# EAGLE design Kopfhörerverstärker AmpBoard Rev 1.0 (EAGLE 6.4)

## Sheet 1 of 3
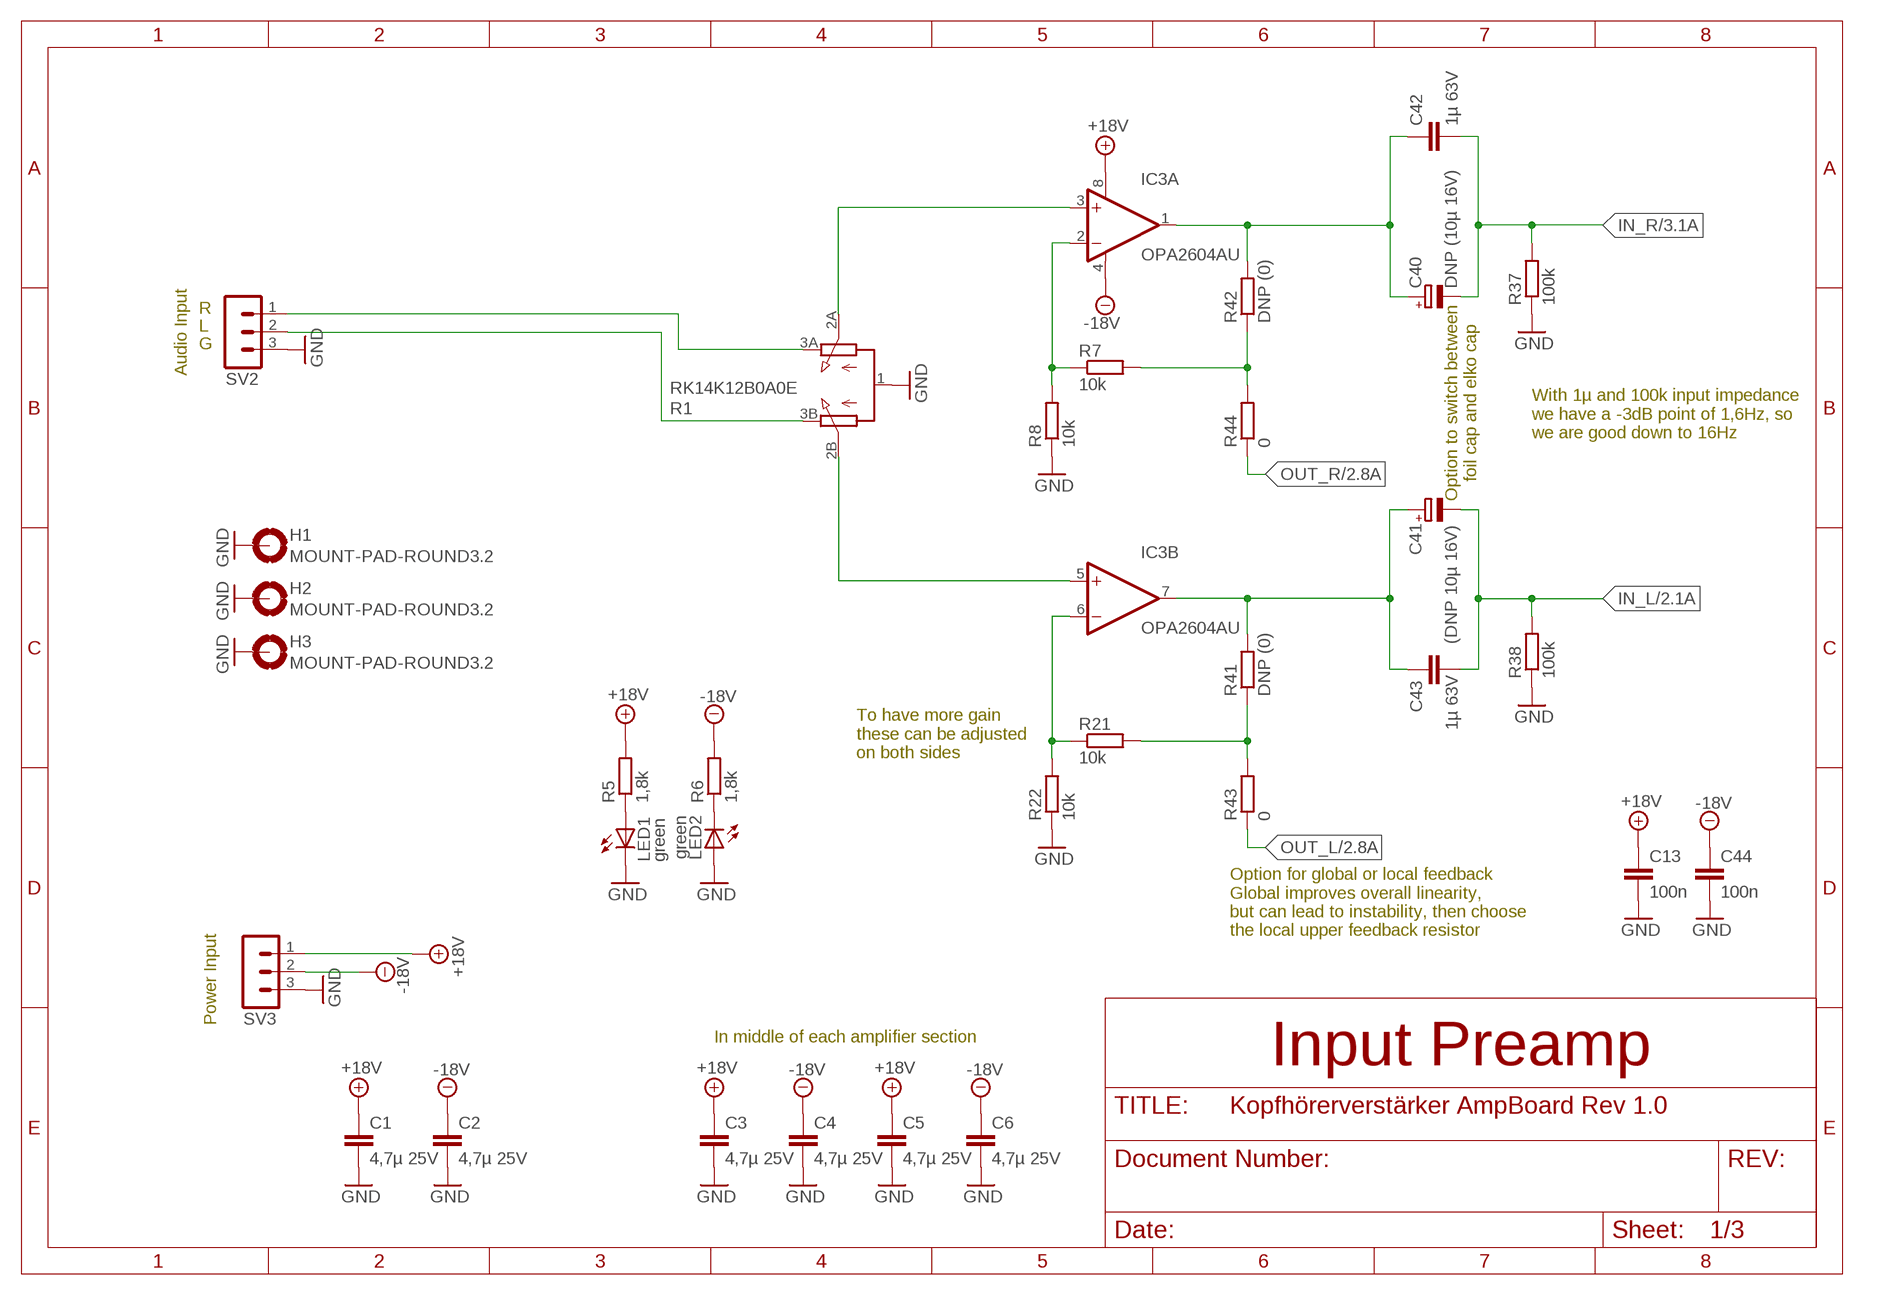
[diagram p0: schematic, sheet 1]

### Parts
C1  4,7µ 25V  C-EUC0805  [C0805]
C2  4,7µ 25V  C-EUC0805  [C0805]
C3  4,7µ 25V  C-EUC0805  [C0805]
C4  4,7µ 25V  C-EUC0805  [C0805]
C5  4,7µ 25V  C-EUC0805  [C0805]
C6  4,7µ 25V  C-EUC0805  [C0805]
C13  100n  C-EUC0805  [C0805]
C40  DNP (10µ 16V)  CPOL-EUE2.5-5  [E2,5-5]
C41  (DNP 10µ 16V)  CPOL-EUE2.5-5  [E2,5-5]
C42  1µ 63V  C-EU050-050X075  [C050-050X075]
C43  1µ 63V  C-EU050-050X075  [C050-050X075]
C44  100n  C-EUC0805  [C0805]
H1  MOUNT-PAD-ROUND3.2  [3,2-PAD]
H2  MOUNT-PAD-ROUND3.2  [3,2-PAD]
H3  MOUNT-PAD-ROUND3.2  [3,2-PAD]
IC3  OPA2604AU  [SO08]
LED1  green  LED3MM  [LED3MM]
LED2  green  LED3MM  [LED3MM]
R1  RK14K12B0A0E  RK14K12X  [RK14K12]
R5  1,8k  R-EU_R0805  [R0805]
R6  1,8k  R-EU_R0805  [R0805]
R7  10k  R-EU_R0805  [R0805]
R8  10k  R-EU_R0805  [R0805]
R21  10k  R-EU_R0805  [R0805]
R22  10k  R-EU_R0805  [R0805]
R37  100k  R-EU_R0805  [R0805]
R38  100k  R-EU_R0805  [R0805]
R41  DNP (0)  R-EU_R0805  [R0805]
R42  DNP (0)  R-EU_R0805  [R0805]
R43  0  R-EU_R0805  [R0805]
R44  0  R-EU_R0805  [R0805]
SV2  MA03-1  [MA03-1]
SV3  MA03-1  [MA03-1]

### Nets
+18V: C1.1 C3.1 C5.1 C13.1 IC3.8(A:V+) R5.2 SV3.1 ; also sheet 2,3
-18V: C2.1 C4.1 C6.1 C44.1 IC3.4(A:V-) R6.2 SV3.2 ; also sheet 2,3
GND: C1.2 C2.2 C3.2 C4.2 C5.2 C6.2 C13.2 C44.2 H1.B3,2(MOUNT) H2.B3,2(MOUNT) H3.B3,2(MOUNT) LED1.K(C) LED2.A R1.1 R8.1 R22.1 R37.1 R38.1 SV2.3 SV3.3 ; also sheet 2,3
IN_L: C41.- C43.2 R38.2 ; also sheet 2
IN_R: C40.- C42.2 R37.2 ; also sheet 3
N$1: R1.3A SV2.1
N$4: R1.3B SV2.2
N$14: LED1.A R5.1
N$15: LED2.K(C) R6.1
N$16: IC3.2(A:-IN) R7.1 R8.2
N$17: C40.+ C42.1 IC3.1(A:OUT) R42.2
N$18: IC3.6(B:-IN) R21.1 R22.2
N$33: IC3.5(B:+IN) R1.2B
N$42: IC3.3(A:+IN) R1.2A
N$47: R21.2 R41.1 R43.2
N$48: R7.2 R42.1 R44.2
N$123: C41.+ C43.1 IC3.7(B:OUT) R41.2
OUT_L: R43.1 ; also sheet 2
OUT_R: R44.1 ; also sheet 2,3

### Notes on the sheet
- R
- Audio Input | L
- G
- Option to switch between
  foil cap and elko cap
- With 1µ and 100k input impedance
  we have a -3dB point of 1,6Hz, so 
  we are good down to 16Hz
- To have more gain
  these can be adjusted
  on both sides
- Option for global or local feedback
  Global improves overall linearity,
  but can lead to instability, then choose
  the local upper feedback resistor
- Power Input
- In middle of each amplifier section | Input Preamp

## Sheet 2 of 3
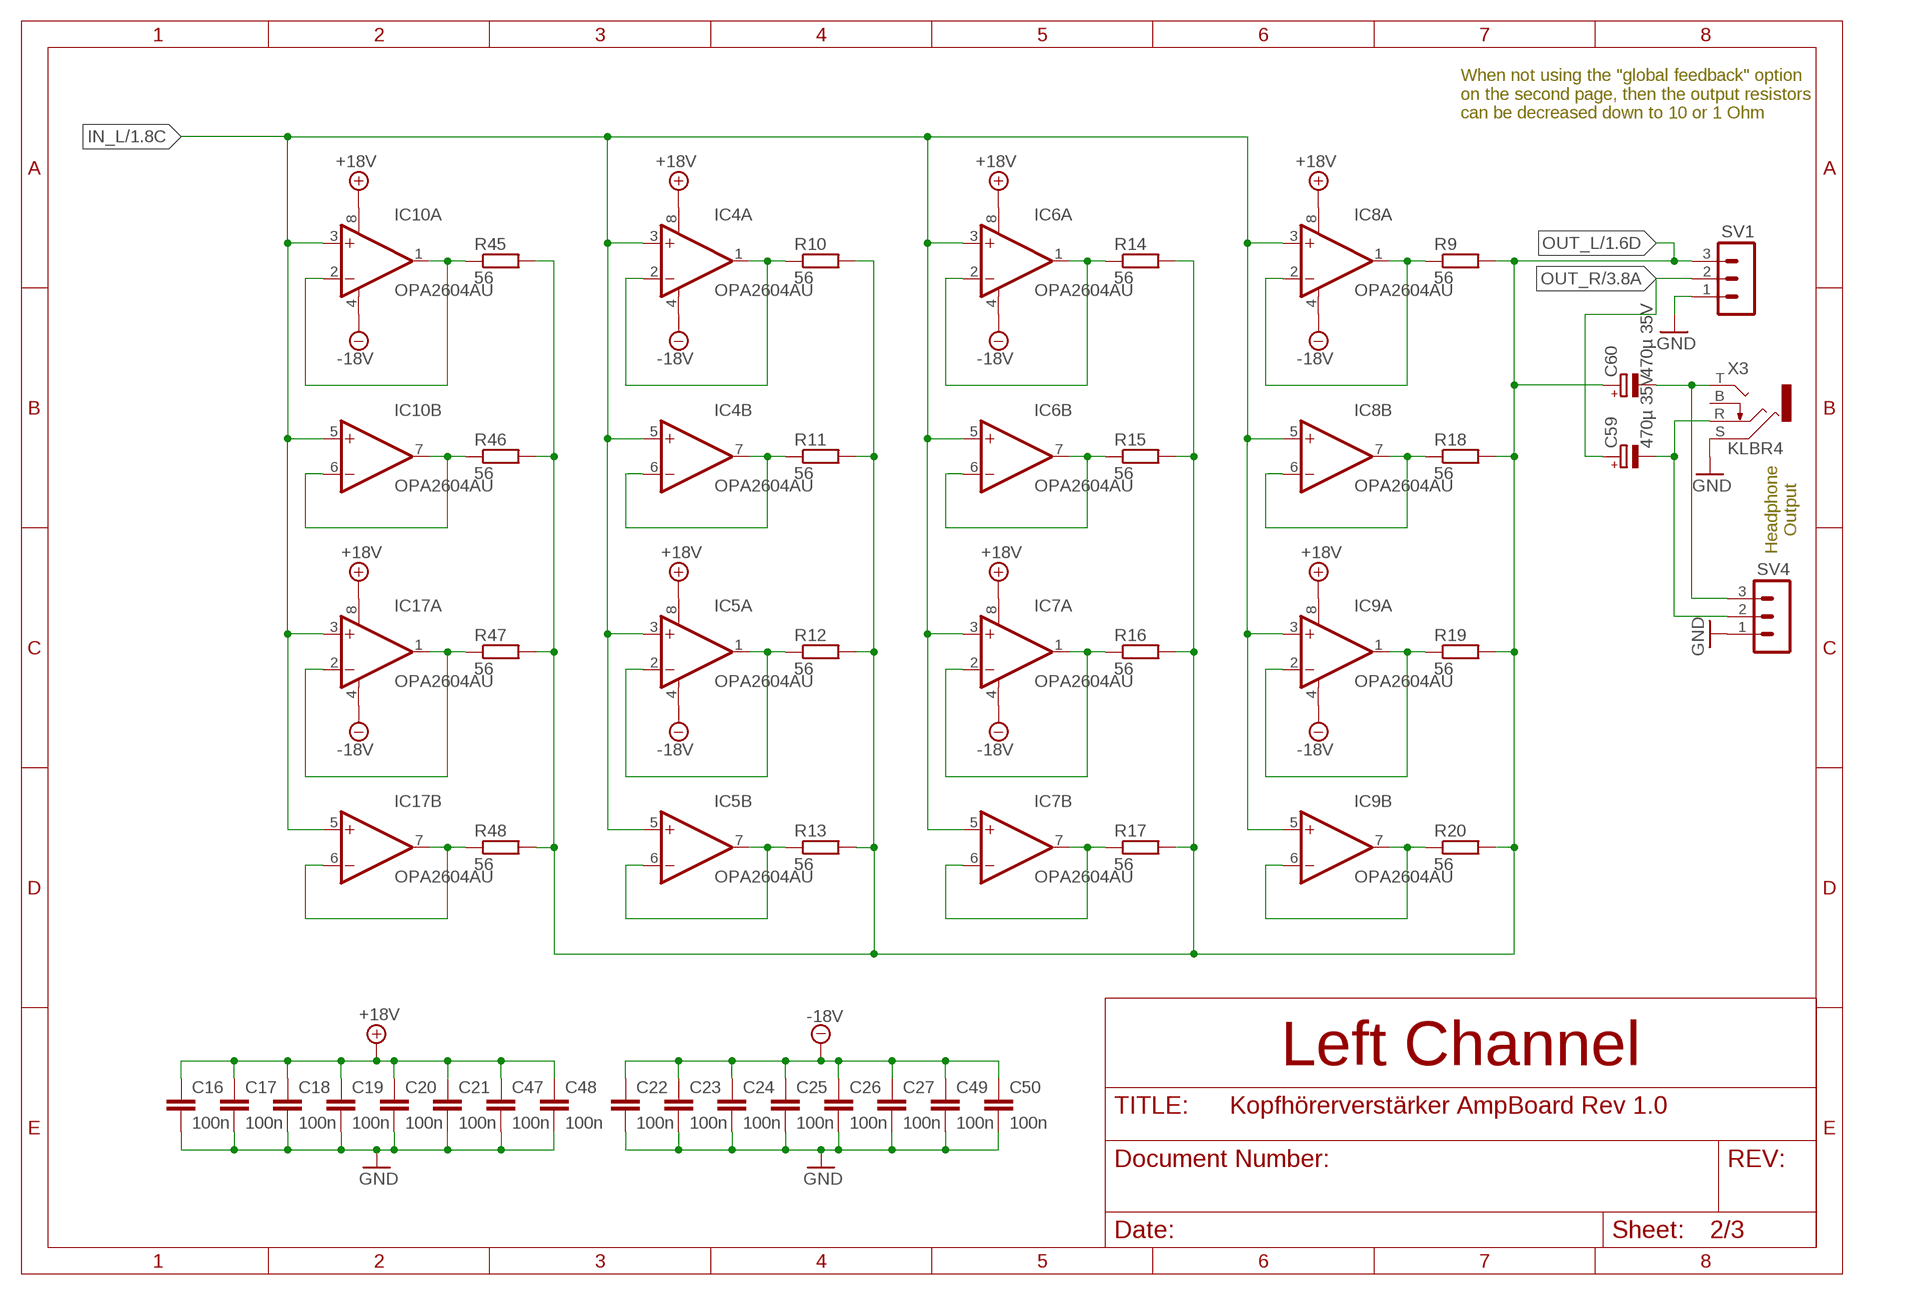
[diagram p1: schematic, sheet 2]

### Parts
C16  100n  C-EUC0805  [C0805]
C17  100n  C-EUC0805  [C0805]
C18  100n  C-EUC0805  [C0805]
C19  100n  C-EUC0805  [C0805]
C20  100n  C-EUC0805  [C0805]
C21  100n  C-EUC0805  [C0805]
C22  100n  C-EUC0805  [C0805]
C23  100n  C-EUC0805  [C0805]
C24  100n  C-EUC0805  [C0805]
C25  100n  C-EUC0805  [C0805]
C26  100n  C-EUC0805  [C0805]
C27  100n  C-EUC0805  [C0805]
C47  100n  C-EUC0805  [C0805]
C48  100n  C-EUC0805  [C0805]
C49  100n  C-EUC0805  [C0805]
C50  100n  C-EUC0805  [C0805]
C59  470µ 35V  CPOL-EUE5-10.5  [E5-10,5]
C60  470µ 35V  CPOL-EUE5-10.5  [E5-10,5]
IC4  OPA2604AU  [SO08]
IC5  OPA2604AU  [SO08]
IC6  OPA2604AU  [SO08]
IC7  OPA2604AU  [SO08]
IC8  OPA2604AU  [SO08]
IC9  OPA2604AU  [SO08]
IC10  OPA2604AU  [SO08]
IC17  OPA2604AU  [SO08]
R9  56  R-EU_R0805  [R0805]
R10  56  R-EU_R0805  [R0805]
R11  56  R-EU_R0805  [R0805]
R12  56  R-EU_R0805  [R0805]
R13  56  R-EU_R0805  [R0805]
R14  56  R-EU_R0805  [R0805]
R15  56  R-EU_R0805  [R0805]
R16  56  R-EU_R0805  [R0805]
R17  56  R-EU_R0805  [R0805]
R18  56  R-EU_R0805  [R0805]
R19  56  R-EU_R0805  [R0805]
R20  56  R-EU_R0805  [R0805]
R45  56  R-EU_R0805  [R0805]
R46  56  R-EU_R0805  [R0805]
R47  56  R-EU_R0805  [R0805]
R48  56  R-EU_R0805  [R0805]
SV1  MA03-1  [MA03-1]
SV4  MA03-1  [MA03-1]
X3  KLBR4  [KLBR4]

### Nets
+18V: C16.1 C17.1 C18.1 C19.1 C20.1 C21.1 C47.1 C48.1 IC4.8(A:V+) IC5.8(A:V+) IC6.8(A:V+) IC7.8(A:V+) IC8.8(A:V+) IC9.8(A:V+) IC10.8(A:V+) IC17.8(A:V+) ; also sheet 1,3
-18V: C22.1 C23.1 C24.1 C25.1 C26.1 C27.1 C49.1 C50.1 IC4.4(A:V-) IC5.4(A:V-) IC6.4(A:V-) IC7.4(A:V-) IC8.4(A:V-) IC9.4(A:V-) IC10.4(A:V-) IC17.4(A:V-) ; also sheet 1,3
GND: C16.2 C17.2 C18.2 C19.2 C20.2 C21.2 C22.2 C23.2 C24.2 C25.2 C26.2 C27.2 C47.2 C48.2 C49.2 C50.2 SV1.1 SV4.1 X3.S ; also sheet 1,3
IN_L: IC4.3(A:+IN) IC4.5(B:+IN) IC5.3(A:+IN) IC5.5(B:+IN) IC6.3(A:+IN) IC6.5(B:+IN) IC7.3(A:+IN) IC7.5(B:+IN) IC8.3(A:+IN) IC8.5(B:+IN) IC9.3(A:+IN) IC9.5(B:+IN) IC10.3(A:+IN) IC10.5(B:+IN) IC17.3(A:+IN) IC17.5(B:+IN) ; also sheet 1
N$2: C59.- SV4.2 X3.R
N$3: C60.- SV4.3 X3.T
N$12: IC4.6(B:-IN) IC4.7(B:OUT) R11.1
N$13: IC5.1(A:OUT) IC5.2(A:-IN) R12.1
N$19: IC8.1(A:OUT) IC8.2(A:-IN) R9.1
N$21: IC4.1(A:OUT) IC4.2(A:-IN) R10.1
N$22: IC5.6(B:-IN) IC5.7(B:OUT) R13.1
N$23: IC6.1(A:OUT) IC6.2(A:-IN) R14.1
N$24: IC6.6(B:-IN) IC6.7(B:OUT) R15.1
N$25: IC7.1(A:OUT) IC7.2(A:-IN) R16.1
N$26: IC7.6(B:-IN) IC7.7(B:OUT) R17.1
N$28: IC8.6(B:-IN) IC8.7(B:OUT) R18.1
N$29: IC9.1(A:OUT) IC9.2(A:-IN) R19.1
N$30: IC9.6(B:-IN) IC9.7(B:OUT) R20.1
N$50: IC10.1(A:OUT) IC10.2(A:-IN) R45.1
N$51: IC10.6(B:-IN) IC10.7(B:OUT) R46.1
N$52: IC17.1(A:OUT) IC17.2(A:-IN) R47.1
N$53: IC17.6(B:-IN) IC17.7(B:OUT) R48.1
OUT_L: C60.+ R9.2 R10.2 R11.2 R12.2 R13.2 R14.2 R15.2 R16.2 R17.2 R18.2 R19.2 R20.2 R45.2 R46.2 R47.2 R48.2 SV1.3 ; also sheet 1
OUT_R: C59.+ SV1.2 ; also sheet 1,3
Unconnected: X3.B

### Notes on the sheet
- When not using the "global feedback" option
  on the second page, then the output resistors
  can be decreased down to 10 or 1 Ohm
- Headphone
  Output
- Left Channel

## Sheet 3 of 3
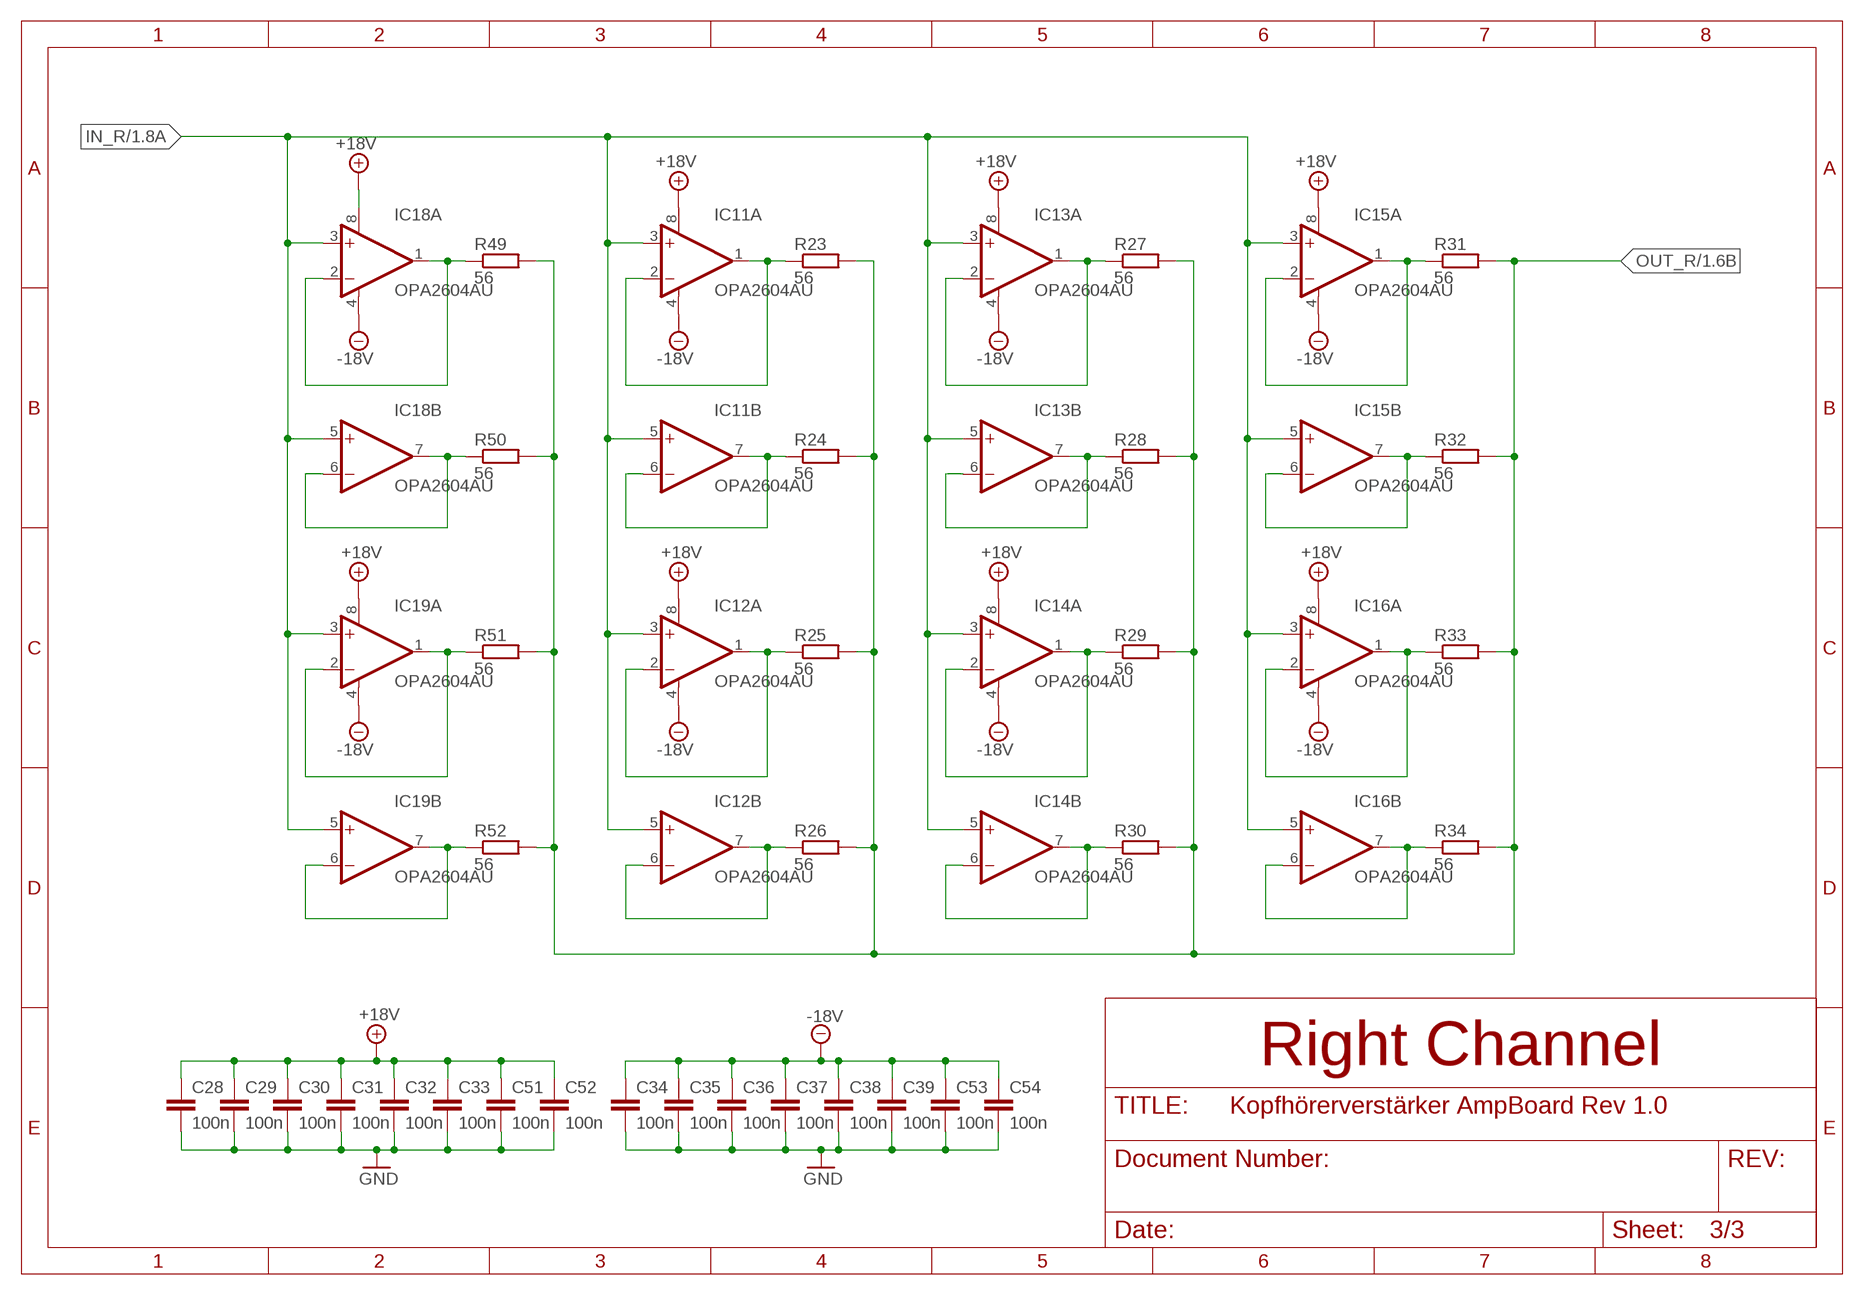
[diagram p2: schematic, sheet 3]

### Parts
C28  100n  C-EUC0805  [C0805]
C29  100n  C-EUC0805  [C0805]
C30  100n  C-EUC0805  [C0805]
C31  100n  C-EUC0805  [C0805]
C32  100n  C-EUC0805  [C0805]
C33  100n  C-EUC0805  [C0805]
C34  100n  C-EUC0805  [C0805]
C35  100n  C-EUC0805  [C0805]
C36  100n  C-EUC0805  [C0805]
C37  100n  C-EUC0805  [C0805]
C38  100n  C-EUC0805  [C0805]
C39  100n  C-EUC0805  [C0805]
C51  100n  C-EUC0805  [C0805]
C52  100n  C-EUC0805  [C0805]
C53  100n  C-EUC0805  [C0805]
C54  100n  C-EUC0805  [C0805]
IC11  OPA2604AU  [SO08]
IC12  OPA2604AU  [SO08]
IC13  OPA2604AU  [SO08]
IC14  OPA2604AU  [SO08]
IC15  OPA2604AU  [SO08]
IC16  OPA2604AU  [SO08]
IC18  OPA2604AU  [SO08]
IC19  OPA2604AU  [SO08]
R23  56  R-EU_R0805  [R0805]
R24  56  R-EU_R0805  [R0805]
R25  56  R-EU_R0805  [R0805]
R26  56  R-EU_R0805  [R0805]
R27  56  R-EU_R0805  [R0805]
R28  56  R-EU_R0805  [R0805]
R29  56  R-EU_R0805  [R0805]
R30  56  R-EU_R0805  [R0805]
R31  56  R-EU_R0805  [R0805]
R32  56  R-EU_R0805  [R0805]
R33  56  R-EU_R0805  [R0805]
R34  56  R-EU_R0805  [R0805]
R49  56  R-EU_R0805  [R0805]
R50  56  R-EU_R0805  [R0805]
R51  56  R-EU_R0805  [R0805]
R52  56  R-EU_R0805  [R0805]

### Nets
+18V: C28.1 C29.1 C30.1 C31.1 C32.1 C33.1 C51.1 C52.1 IC11.8(A:V+) IC12.8(A:V+) IC13.8(A:V+) IC14.8(A:V+) IC15.8(A:V+) IC16.8(A:V+) IC18.8(A:V+) IC19.8(A:V+) ; also sheet 1,2
-18V: C34.1 C35.1 C36.1 C37.1 C38.1 C39.1 C53.1 C54.1 IC11.4(A:V-) IC12.4(A:V-) IC13.4(A:V-) IC14.4(A:V-) IC15.4(A:V-) IC16.4(A:V-) IC18.4(A:V-) IC19.4(A:V-) ; also sheet 1,2
GND: C28.2 C29.2 C30.2 C31.2 C32.2 C33.2 C34.2 C35.2 C36.2 C37.2 C38.2 C39.2 C51.2 C52.2 C53.2 C54.2 ; also sheet 1,2
IN_R: IC11.3(A:+IN) IC11.5(B:+IN) IC12.3(A:+IN) IC12.5(B:+IN) IC13.3(A:+IN) IC13.5(B:+IN) IC14.3(A:+IN) IC14.5(B:+IN) IC15.3(A:+IN) IC15.5(B:+IN) IC16.3(A:+IN) IC16.5(B:+IN) IC18.3(A:+IN) IC18.5(B:+IN) IC19.3(A:+IN) IC19.5(B:+IN) ; also sheet 1
N$20: IC11.1(A:OUT) IC11.2(A:-IN) R23.1
N$27: IC11.6(B:-IN) IC11.7(B:OUT) R24.1
N$31: IC12.1(A:OUT) IC12.2(A:-IN) R25.1
N$32: IC12.6(B:-IN) IC12.7(B:OUT) R26.1
N$34: IC13.1(A:OUT) IC13.2(A:-IN) R27.1
N$35: IC13.6(B:-IN) IC13.7(B:OUT) R28.1
N$36: IC14.1(A:OUT) IC14.2(A:-IN) R29.1
N$37: IC14.6(B:-IN) IC14.7(B:OUT) R30.1
N$38: IC15.1(A:OUT) IC15.2(A:-IN) R31.1
N$39: IC15.6(B:-IN) IC15.7(B:OUT) R32.1
N$40: IC16.1(A:OUT) IC16.2(A:-IN) R33.1
N$41: IC16.6(B:-IN) IC16.7(B:OUT) R34.1
N$49: IC18.1(A:OUT) IC18.2(A:-IN) R49.1
N$55: IC18.6(B:-IN) IC18.7(B:OUT) R50.1
N$56: IC19.1(A:OUT) IC19.2(A:-IN) R51.1
N$57: IC19.6(B:-IN) IC19.7(B:OUT) R52.1
OUT_R: R23.2 R24.2 R25.2 R26.2 R27.2 R28.2 R29.2 R30.2 R31.2 R32.2 R33.2 R34.2 R49.2 R50.2 R51.2 R52.2 ; also sheet 1,2

### Notes on the sheet
- Right Channel

## Library data of the parts
C1-C6 C13 C16-C39 C42-C44 C47-C54 = rcl:C-EU: CAPACITOR, European symbol
C40 C41 C59 C60 = rcl:CPOL-EU: POLARIZED CAPACITOR, European symbol
H1-H3 = holes:MOUNT-PAD-ROUND: MOUNTING PAD, round
IC3-IC19 = burr-brown:OPA2604: Dual FET-Input, Low Distortion LOW DISTORTION: 0.0003% at 1kHz LOW NOISE: 10nV/vHz HIGH SLEW RATE: 25V/µ s WIDE GAIN-BANDWIDTH: 20MHz UNITY-GAIN STABLE WIDE SUPPLY RANGE: VS = ±4.5 to ±24V DRIVES 600? LOADS
LED1 LED2 = led:LED: LED OSRAM: - CHIPLED LG R971, LG N971, LY N971, LG Q971, LY Q971, LO R971, LY R971 LH N974, LH R974 LS Q976, LO Q976, LY Q976 LO Q996 - Hyper CHIPLED LW Q18S LB Q993, LB Q99A, LB R99A - SideLED LS A670, LO A670, LY A670, LG A670, LP A670 LB A673, LV A673, LT A673, LW A673 LH A674 LY A675 LS A676, LA A676, LO A676, LY A676, LW A676 LS A679, LY A679, LG A679 - Hyper Micro SIDELED® LS Y876, LA Y876, LO Y876, LY Y876 LT Y87S - SmartLED LW L88C, LW L88S LB L89C, LB L89S, LG L890 LS L89K, LO L89K, LY L89K LS L896, LA L896, LO L896, LY L896 - TOPLED LS T670, LO T670, LY T670, LG T670, LP T670 LSG T670, LSP T670, LSY T670, LOP T670, LYG T670 LG T671, LOG T671, LSG T671 LB T673, LV T673, LT T673, LW T673 LH T674 LS T676, LA T676, LO T676, LY T676, LB T676, LH T676, LSB T676, LW T676 LB T67C, LV T67C, LT T67C, LS T67K, LO T67K, LY T67K, LW E67C LS E67B, LA E67B, LO E67B, LY E67B, LB E67C, LV E67C, LT E67C LW T67C LS T679, LY T679, LG T679 LS T770, LO T770, LY T770, LG T770, LP T770 LB T773, LV T773, LT T773, LW T773 LH T774 LS E675, LA E675, LY E675, LS T675 LS T776, LA T776, LO T776, LY T776, LB T776 LHGB T686 LT T68C, LB T68C - Hyper Mini TOPLED® LB M676 - Mini TOPLED Santana® LG M470 LS M47K, LO M47K, LY M47K Source: http://www.osram.convergy.de LUXEON: - LUMILED® LXK2-PW12-R00, LXK2-PW12-S00, LXK2-PW14-U00, LXK2-PW14-V00 LXK2-PM12-R00, LXK2-PM12-S00, LXK2-PM14-U00 LXK2-PE12-Q00, LXK2-PE12-R00, LXK2-PE12-S00, LXK2-PE14-T00, LXK2-PE14-U00 LXK2-PB12-K00, LXK2-PB12-L00, LXK2-PB12-M00, LXK2-PB14-N00, LXK2-PB14-P00, LXK2-PB14-Q00 LXK2-PR12-L00, LXK2-PR12-M00, LXK2-PR14-Q00, LXK2-PR14-R00 LXK2-PD12-Q00, LXK2-PD12-R00, LXK2-PD12-S00 LXK2-PH12-R00, LXK2-PH12-S00 LXK2-PL12-P00, LXK2-PL12-Q00, LXK2-PL12-R00 Source: www.luxeon.com KINGBRIGHT: KA-3528ASYC Source: www.kingbright.com
R1 = pot:RK14K12X: RK14K Series Features - Closed structure improved dust-proofing capacity and flux resistance - Available with bushing, tap and detent Applications - Sound volume, tone and balance controls for audio devices - Controls for audio mixes, musical instruments and image devicesincluding DVD players
R5-R34 R37 R38 R41-R52 = rcl:R-EU_: RESISTOR, European symbol
SV1-SV4 = con-lstb:MA03-1: PIN HEADER; OC_FARNELL: unknown; OC_NEWARK: unknown
X3 = con-lumberg:KLBR4: Jack connectors according to JISC 6560, 3.5 mm Klinkeneinbaukupplung nach JISC 6560, 3,5 mm, 3-polig/ stereo, abgewinkelte Ausführung, mit Öffner, für Leiterplatten Source: Data sheet <http://www.lumberg.com/Produkte/PDFs/KLBR4.pdf>; MPN: KLBR 4; OC_FARNELL: 1217016; OC_NEWARK: 97K2709

## Board
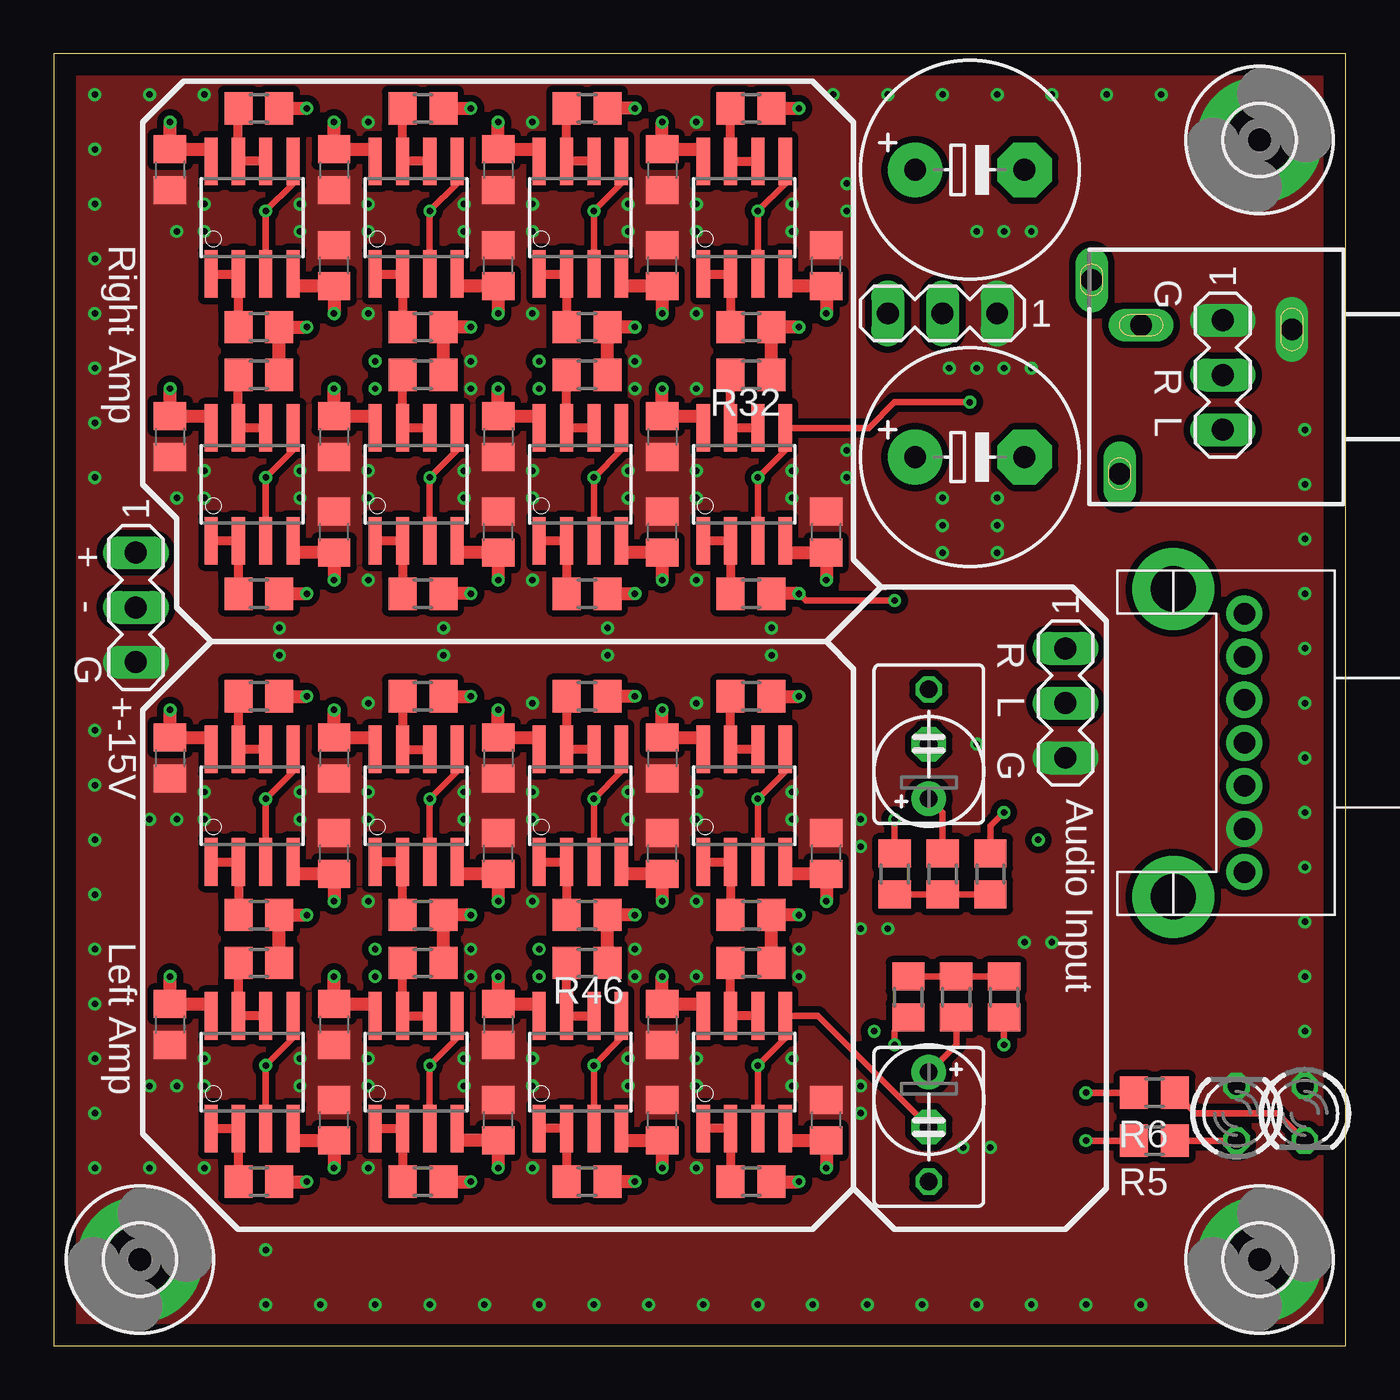
[diagram p3: board, top side]
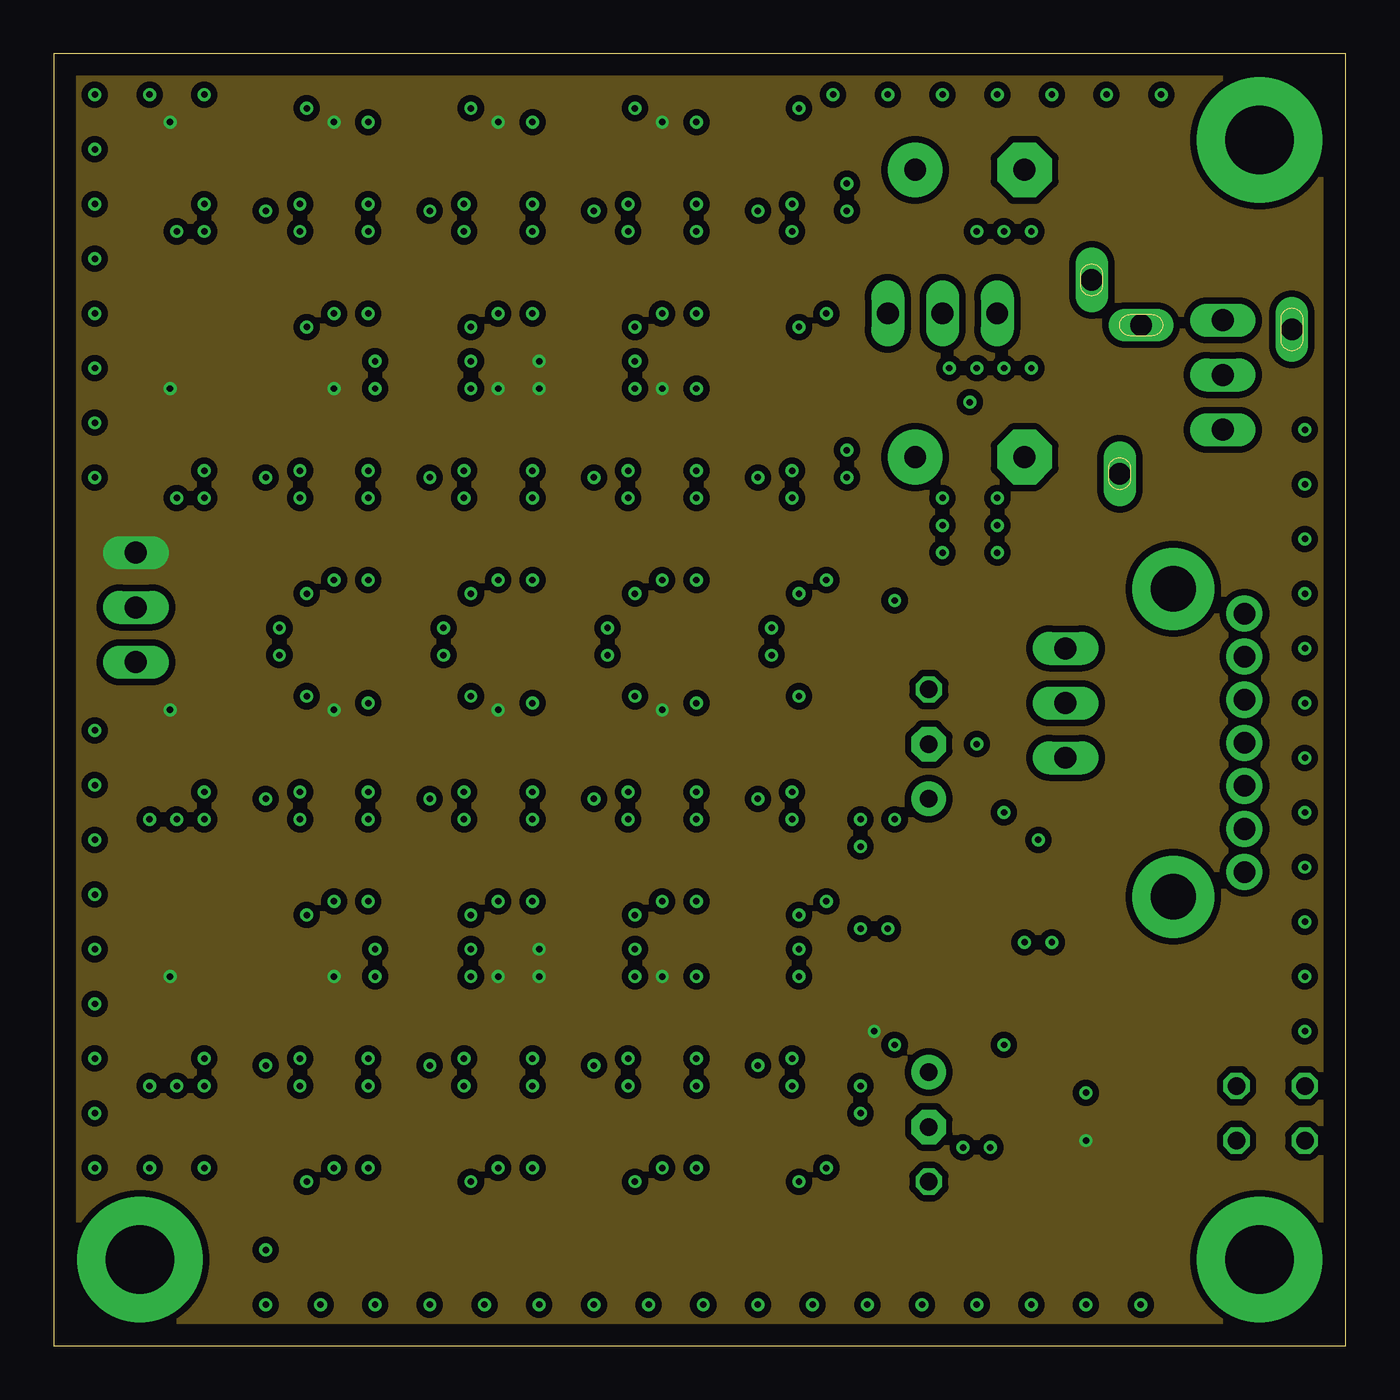
[diagram p4: board, inner layer Route2]
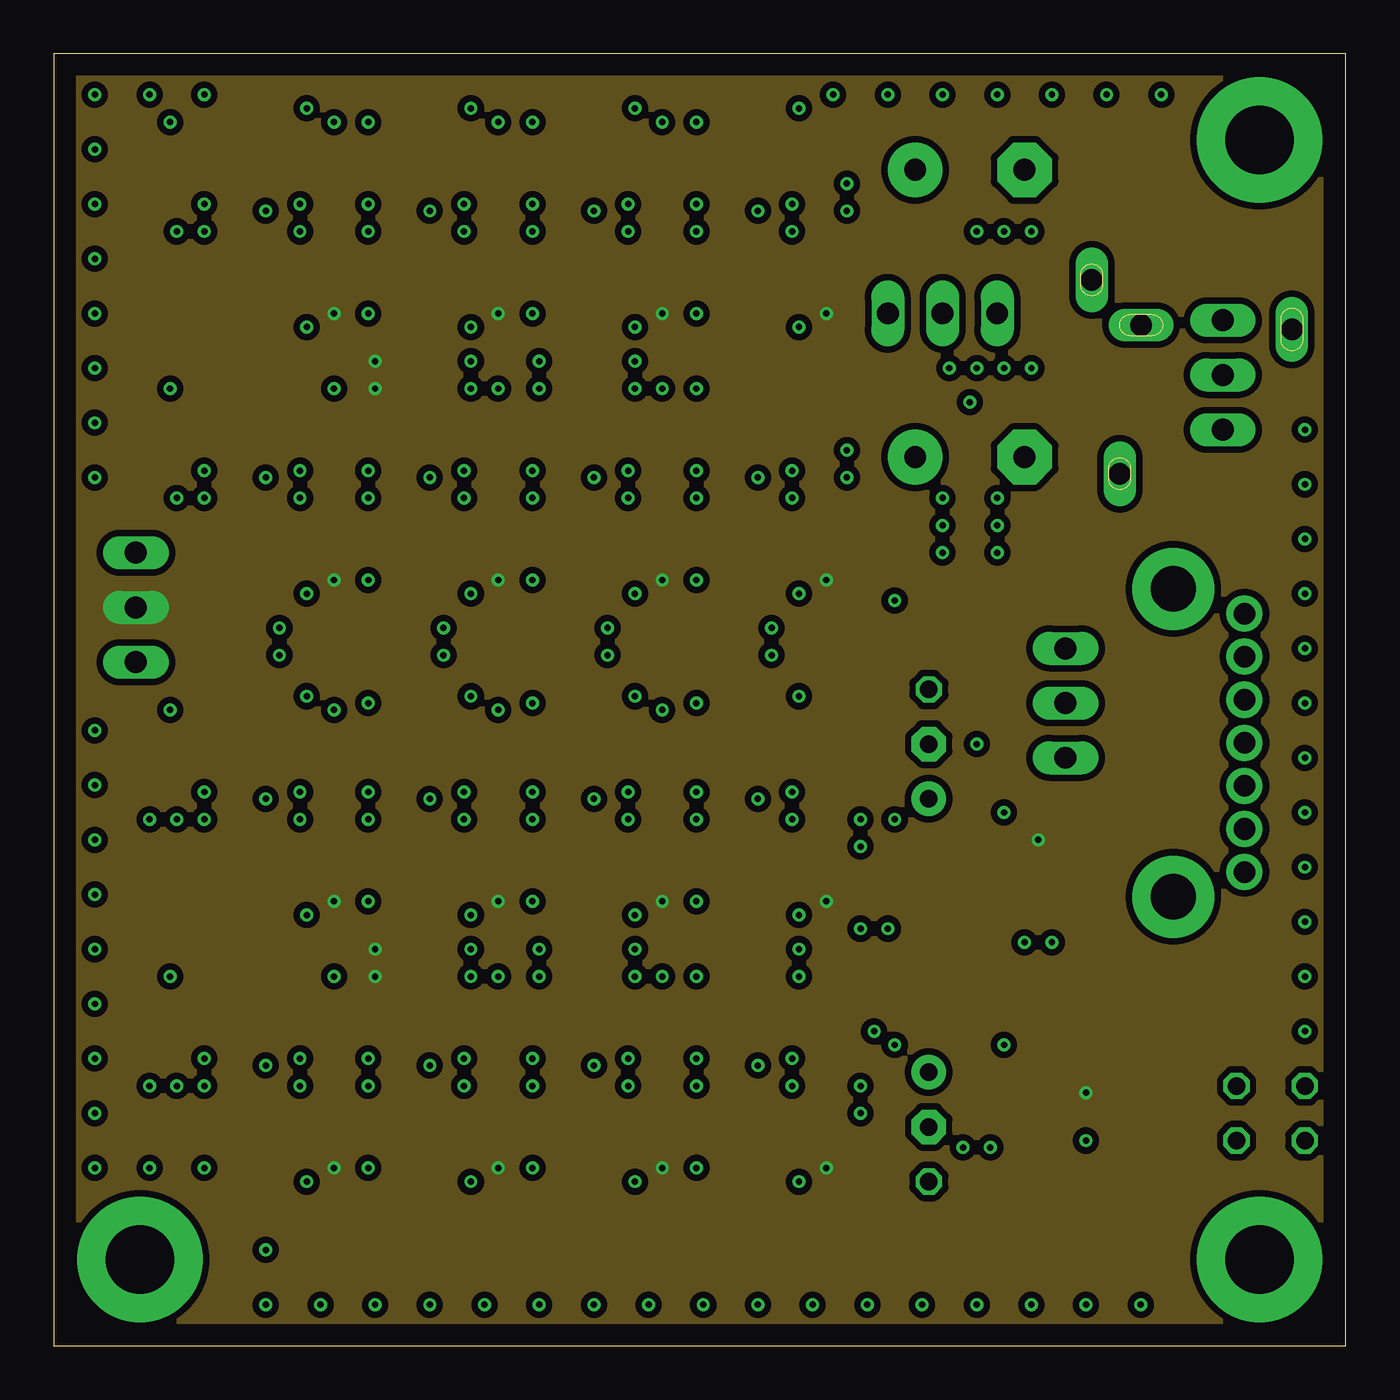
[diagram p5: board, inner layer Route15]
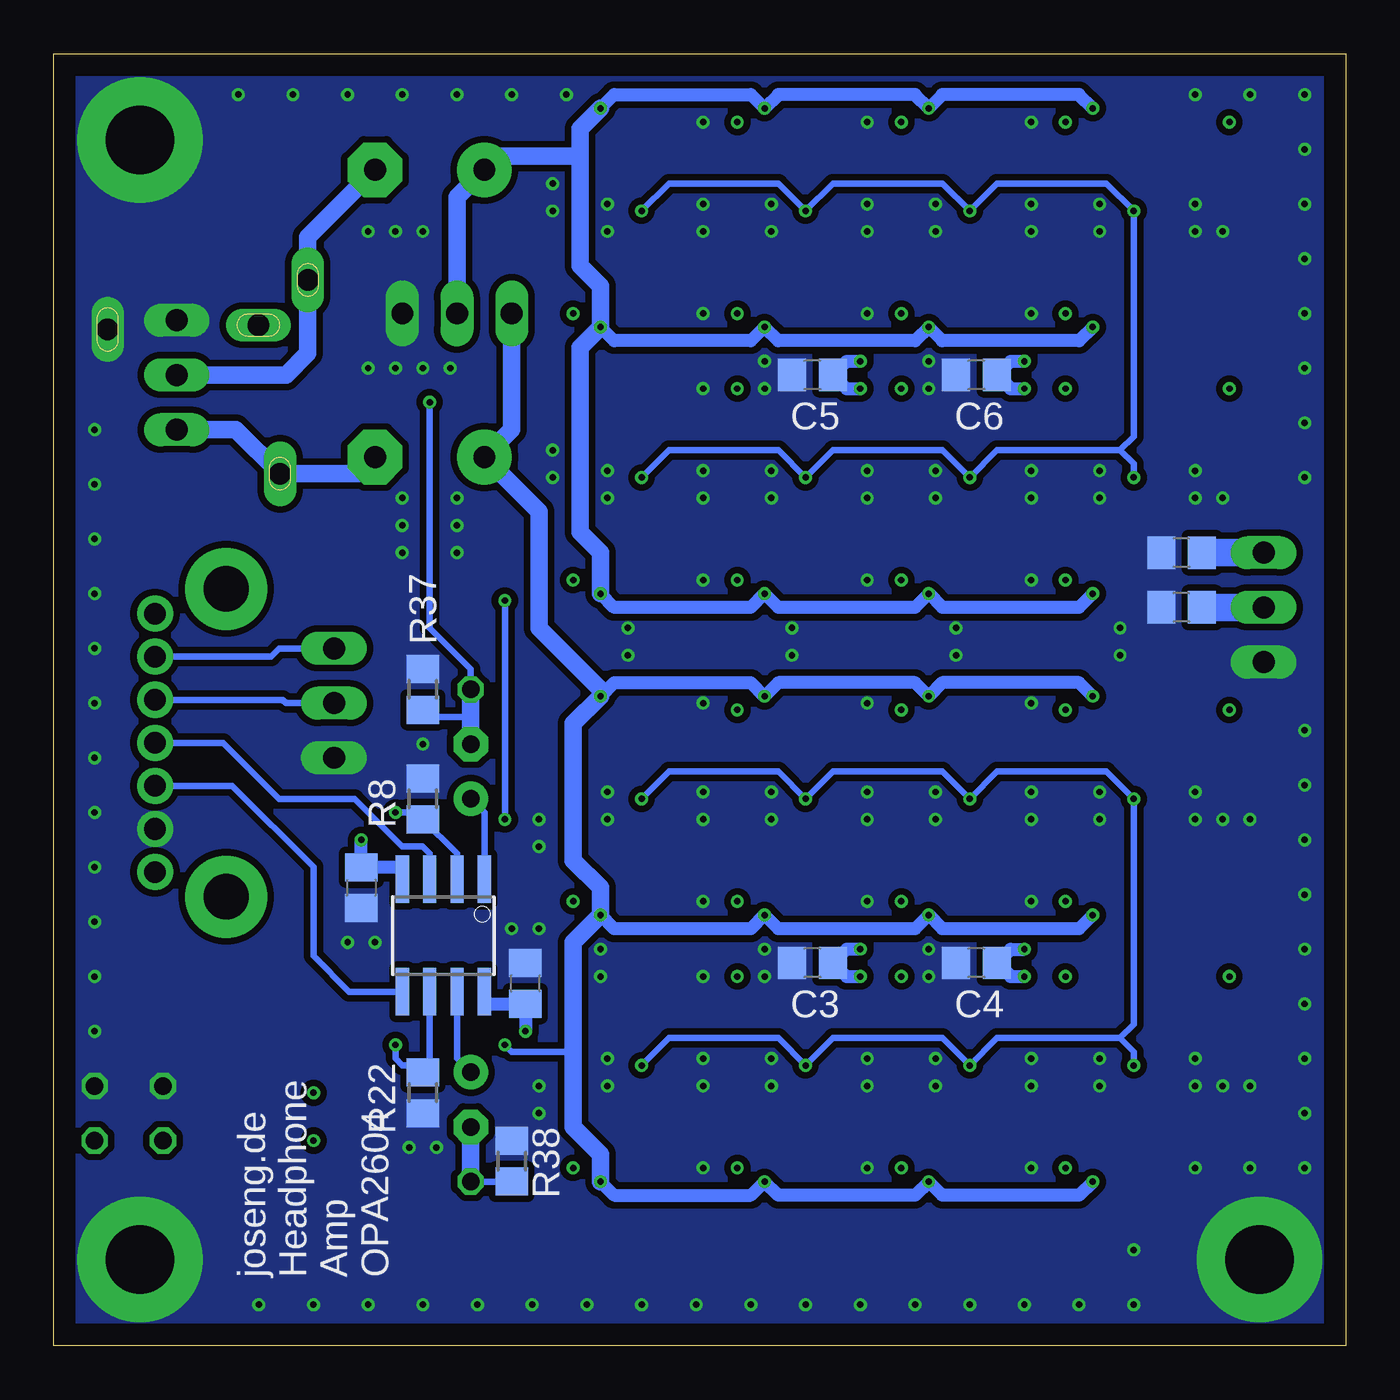
[diagram p6: board, bottom side, seen from below]

Size 60 x 60 mm. Coordinates in mm from the lower left corner, seen from the top.
Outline: 0,0 60,0 60,60 0,60 0,0
Copper layers ((1+2)*(15+16)): Top 0.035mm / dielectric 0.2mm / Route2 0.0175mm / dielectric 1.065mm / Route15 0.0175mm / dielectric 0.2mm / Bottom 0.035mm
Design rules "JLCPCB 4Layer 1oz JLC7628": minimum track width 3.5mil, minimum drill 0.2mm, track to track 3.5mil, track to pad 0.2mm, pad to pad 5mil, via to via 0.2mm, smd to smd 5mil, copper to edge 40mil, drill to drill 0.5mm, minimum pad ring 0.15mm, minimum via ring 0.15mm, stop-mask expansion 2mil, vias tented up to drill 0.3mm, thermal gap 10mil

### Footprints (pad centres in the part's own frame; a part is rotated, then mirrored left to right if it is on the bottom)
C0805 = smd 1.3 x 1.5: 1 -0.95,0; 2 0.95,0
E2,5-5 = drill 0.813 pad 1.6: + -1.27,0 | drill 0.813 pad 1.6 octagon: - 1.27,0
C050-050X075 = drill 0.813 octagon: 1 -2.54,0; 2 2.54,0
E5-10,5 = drill 1.016 pad 2.54: + -2.54,0 | drill 1.016 pad 2.54 octagon: - 2.54,0
3,2-PAD = drill 3.2 pad 5.842: B3,2 0,0
SO08 = smd 0.61 x 2.21: 1 -1.905,-2.616; 2 -0.635,-2.616; 3 0.635,-2.616; 4 1.905,-2.616; 5 1.905,2.616; 6 0.635,2.616; 7 -0.635,2.616; 8 -1.905,2.616
LED3MM = drill 0.813 octagon: A -1.27,0; K 1.27,0
RK14K12 = drill 1 pad 1.676: 1 3.3,-4; 2A 3.3,0; 2B 3.3,-2; 3A 3.3,4; 3B 3.3,2; D1 3.3,-6; D2 3.3,6 | drill 2.1 pad 3.81: M1 0,7.15; M2 0,-7.15
R0805 = smd 1.3 x 1.5: 1 -0.95,0; 2 0.95,0
MA03-1 = drill 1.016 long: 1 -2.54,0; 2 0,0; 3 2.54,0
KLBR4 = drill 1 pad 1.3 long: B -2.4,-3.5; S -2.2,3.5 | drill 1 pad 1.2 long: R -4.5,-5.8; T 4.5,-4.5

### Placement (x,y rotation side)
C1  7.62,36.83 180 bottom
C2  7.62,34.29 180 bottom
C3  24.77,17.78 180 bottom
C4  17.14,17.78 180 bottom
C5  24.77,45.09 180 bottom
C6  17.14,45.09 180 bottom
C13  38.1,16.83 90 bottom
C16  5.4,27.3 270 top
C17  13.02,27.3 270 top
C18  20.64,27.3 270 top
C19  28.26,27.3 270 top
C20  5.4,14.92 270 top
C21  13.02,14.92 270 top
C22  13.02,22.86 90 top
C23  20.64,22.86 90 top
C24  28.26,22.86 90 top
C25  35.88,22.86 90 top
C26  13.02,10.48 90 top
C27  20.64,10.48 90 top
C28  28.26,54.61 270 top
C29  20.64,54.61 270 top
C30  13.02,54.61 270 top
C31  5.4,54.61 270 top
C32  28.26,42.23 270 top
C33  20.64,42.23 270 top
C34  35.88,50.16 90 top
C35  28.26,50.16 90 top
C36  20.64,50.16 90 top
C37  13.02,50.16 90 top
C38  35.88,37.78 90 top
C39  28.26,37.78 90 top
C40  40.64,26.67 90 top
C41  40.64,11.43 270 top
C42  40.64,27.94 90 top
C43  40.64,10.16 270 top
C44  45.72,21.27 270 bottom
C47  20.64,14.92 270 top
C48  28.26,14.92 270 top
C49  28.26,10.48 90 top
C50  35.88,10.48 90 top
C51  13.02,42.23 270 top
C52  5.4,42.23 270 top
C53  20.64,37.78 90 top
C54  13.02,37.78 90 top
C59  42.55,54.61 0 top
C60  42.55,41.27 0 top
H1  4,4 0 top
H2  56,56 0 top
H3  56,4 0 top
IC3  41.91,19.05 180 bottom
IC4  9.21,25.08 0 top
IC5  16.83,25.08 0 top
IC6  24.45,25.08 0 top
IC7  32.07,25.08 0 top
IC8  9.21,12.7 0 top
IC9  16.83,12.7 0 top
IC10  24.45,12.7 0 top
IC11  32.07,52.39 0 top
IC12  24.45,52.39 0 top
IC13  16.83,52.39 0 top
IC14  9.21,52.39 0 top
IC15  32.07,40.01 0 top
IC16  24.45,40.01 0 top
IC17  32.07,12.7 0 top
IC18  16.83,40.01 0 top
IC19  9.21,40.01 0 top
LED1  54.93,10.79 90 top
LED2  58.1,10.79 270 top
R1  52,28 0 top
R5  51.12,9.53 180 top
R6  51.12,11.75 180 top
R7  43.5,21.91 270 top
R8  42.86,25.4 270 bottom
R9  9.53,7.62 0 top
R10  9.53,20 0 top
R11  9.53,30.16 0 top
R12  17.14,20 0 top
R13  17.14,30.16 0 top
R14  24.77,20 0 top
R15  24.77,30.16 0 top
R16  32.38,20 0 top
R17  32.38,30.16 0 top
R18  9.53,17.78 0 top
R19  17.14,7.62 0 top
R20  17.14,17.78 0 top
R21  44.13,16.19 90 top
R22  42.86,11.75 90 bottom
R23  32.38,47.31 0 top
R24  32.38,57.47 0 top
R25  24.77,47.31 0 top
R26  24.77,57.47 0 top
R27  17.14,47.31 0 top
R28  17.14,57.47 0 top
R29  9.53,47.31 0 top
R30  9.53,57.47 0 top
R31  32.38,34.92 0 top
R32  32.38,45.09 0 top
R33  24.77,34.92 0 top
R34  24.77,45.09 0 top
R37  42.86,30.48 270 bottom
R38  38.73,8.57 270 bottom
R41  41.91,16.19 270 top
R42  41.27,21.91 90 top
R43  39.69,16.19 90 top
R44  39.05,21.91 270 top
R45  24.77,7.62 0 top
R46  24.77,17.78 0 top
R47  32.38,7.62 0 top
R48  32.38,17.78 0 top
R49  17.14,34.92 0 top
R50  17.14,45.09 0 top
R51  9.53,34.92 0 top
R52  9.53,45.09 0 top
SV1  41.27,47.94 180 top
SV2  46.99,29.84 270 top
SV3  3.81,34.29 270 top
SV4  54.29,45.09 270 top
X3  54,45 270 top

### Tracks (layer width: path | path; a pad name or v marks a point on that pad's centre or on a via)
+18V  (via drill 0.3, 0.3 pad 0.3)
  Top 0.305: R5.2 v47.94,9.53
  Top 0.61: v28.26,29.53 C19.1 30.16,28.25 IC7.8 | IC5.8 14.92,28.25 C17.1 v13.02,29.53 | IC4.8 7.3,28.25 C16.1 v5.4,29.53 | IC6.8 22.54,28.25 C18.1 v20.64,29.53 | v20.64,17.14 C47.1 22.54,15.87 IC10.8 | IC17.8 30.16,15.87 C48.1 v28.26,17.14 | IC9.8 14.92,15.87 C21.1 v13.02,17.14 | IC8.8 7.3,15.87 C20.1 v5.4,17.14 | v20.64,56.83 C29.1 22.54,55.56 IC12.8 | IC11.8 30.16,55.56 C28.1 v28.26,56.83 | IC19.8 7.3,43.18 C52.1 v5.4,44.45 | IC18.8 14.92,43.18 C51.1 v13.02,44.45 | IC16.8 22.54,43.18 C33.1 v20.64,44.45 | IC15.8 30.16,43.18 C32.1 v28.26,44.45 | IC14.8 7.3,55.56 C31.1 v5.4,56.83 | v13.02,56.83 C30.1 14.92,55.56 IC13.8
  Bottom 0.61: C3.1 23.18,17.14 v22.54,17.14 | v22.54,18.41 23.18,18.41 C3.1 | C5.1 23.18,45.72 v22.54,45.72 | C5.1 23.18,44.45 v22.54,44.45 | IC3.8 40.01,15.88 C13.1 v38.1,14.61
  Bottom 1.27: C1.1 SV3.1
  pour Route2 (isolate 0.305, no thermals): -1.27,-1.27 60.96,-1.27 60.96,63.5 -1.27,63.5
-18V  (via drill 0.3, 0.3 pad 0.3)
  Top 0.305: R6.2 v47.94,11.75
  Top 0.61: IC6.4 26.35,21.91 C24.1 v28.26,20.64 | IC7.4 33.97,21.91 C25.1 v35.88,20.64 | IC5.4 18.73,21.91 C23.1 v20.64,20.64 | IC4.4 11.11,21.91 C22.1 v13.02,20.64 | IC9.4 18.73,9.53 C27.1 v20.64,8.26 | IC10.4 26.35,9.53 C49.1 v28.26,8.26 | IC17.4 33.97,9.53 C50.1 v35.88,8.26 | IC8.4 11.11,9.53 C26.1 v13.02,8.26 | IC11.4 33.97,49.22 C34.1 v35.88,47.94 | IC12.4 26.35,49.22 C35.1 v28.26,47.94 | IC13.4 18.73,49.22 C36.1 v20.64,47.94 | IC14.4 11.11,49.22 C37.1 v13.02,47.94 | IC19.4 11.11,36.83 C54.1 v13.02,35.56 | IC18.4 18.73,36.83 C53.1 v20.64,35.56 | IC16.4 26.35,36.83 C39.1 v28.26,35.56 | IC15.4 33.97,36.83 C38.1 v35.88,35.56
  Bottom 0.61: C4.1 15.56,17.14 v14.92,17.14 | C4.1 15.56,18.41 v14.92,18.41 | C4.1 | C6.1 15.56,45.72 v14.92,45.72 | C6.1 15.56,44.45 v14.92,44.45 | IC3.4 43.81,22.22 C44.1 v45.72,23.5
  Bottom 1.27: C2.1 SV3.2
  pour Route15 (isolate 0.305, no thermals): -1.27,-1.27 60.96,-1.27 60.96,62.23 -1.27,62.23
GND  (via drill 0.3)
  other vias: 11.43,25.72 11.43,24.45 14.61,25.72 14.61,24.45 19.05,25.72 19.05,24.45 22.23,25.72 22.23,24.45 26.67,25.72 26.67,24.45 29.84,25.72 29.84,24.45 34.29,25.72 34.29,24.45 6.99,25.72 6.99,24.45 34.29,13.34 34.29,12.06 26.67,13.34 26.67,12.06 19.05,12.06 19.05,13.34 11.43,13.34 11.43,12.06 6.99,12.06 6.99,13.34 14.61,13.34 14.61,12.06 22.23,12.06 22.23,13.34 29.84,13.34 29.84,12.06 37.47,12.06 37.47,10.79 37.47,24.45 37.47,23.18 4.45,24.45 5.71,24.45 5.71,12.06 4.45,12.06 19.37,18.41 19.37,17.14 26.99,18.41 26.99,17.14 19.37,45.72 19.37,44.45 26.99,45.72 26.99,44.45 26.67,53.02 26.67,51.75 19.05,51.75 19.05,53.02 11.43,53.02 11.43,51.75 34.29,53.02 34.29,51.75 34.29,40.64 34.29,39.37 26.67,39.37 26.67,40.64 19.05,40.64 19.05,39.37 11.43,39.37 11.43,40.64 6.99,53.02 6.99,51.75 6.99,40.64 6.99,39.37 14.61,53.02 14.61,51.75 22.23,51.75 22.23,53.02 29.84,53.02 29.84,51.75 36.83,52.7 36.83,53.98 36.83,40.32 36.83,41.59 29.84,40.64 29.84,39.37 22.23,40.64 22.23,39.37 14.61,39.37 14.61,40.64 5.71,39.37 5.71,51.75 10.48,33.34 10.48,32.07 45.09,18.73 46.35,18.73 37.47,19.37 38.73,19.37 42.86,27.94 42.23,9.21 43.5,9.21 9.84,4.45 51.44,58.1 1.91,8.26 4.45,8.26 6.99,8.26 1.91,10.79 1.91,13.34 1.91,58.1 4.45,58.1 6.99,58.1 1.91,55.56 1.91,53.02 48.9,58.1 58.1,42.55 58.1,40.01 58.1,37.47 58.1,34.92 58.1,32.38 58.1,29.84 58.1,27.3 58.1,24.77 58.1,22.23 58.1,19.68 1.91,50.48 1.91,47.94 1.91,45.4 1.91,42.86 1.91,40.32 1.91,15.88 1.91,18.41 1.91,20.95 1.91,23.5 1.91,26.04 1.91,28.57 58.1,14.61 58.1,17.14 50.48,1.91 47.94,1.91 45.4,1.91 42.86,1.91 40.32,1.91 37.78,1.91 35.24,1.91 32.7,1.91 30.16,1.91 27.62,1.91 25.08,1.91 22.54,1.91 20,1.91 17.46,1.91 14.92,1.91 12.38,1.91 9.84,1.91 46.35,58.1 43.81,58.1 41.27,58.1 38.73,58.1 36.2,58.1 29.84,56.83 22.23,56.83 14.61,56.83 14.61,47.94 22.23,47.94 29.84,47.94 29.84,44.45 29.84,35.56 22.23,35.56 14.61,35.56 14.61,29.84 22.23,29.84 29.84,29.84 29.84,8.26 22.23,8.26 14.61,8.26 14.61,20.64 22.23,20.64 29.84,20.64 29.84,17.14 34.61,17.14 34.61,18.41 41.27,38.1 41.27,39.37 41.27,36.83 45.4,45.4 44.13,45.4 42.86,45.4 41.59,45.4 45.4,51.75 44.13,51.75 42.86,51.75 18.1,33.34 18.1,32.07 25.72,33.34 25.72,32.07 33.34,32.07 33.34,33.34 43.81,39.37 43.81,38.1 43.81,36.83
  pour Bottom (isolate 0.305, no thermals): -1.27,-1.27 60.96,-1.27 60.96,60.96 -1.27,60.96
  pour Top (isolate 0.305, no thermals): -1.27,-1.27 60.96,-1.27 60.96,64.77 -1.27,64.77
IN_L  (via drill 0.3)
  Top 0.305: IC4.3 v9.84,25.4 11.11,26.67 IC4.5 | IC5.3 v17.46,25.4 18.73,26.67 IC5.5 | IC6.3 v25.08,25.4 26.35,26.67 IC6.5 | IC7.3 v32.7,25.4 33.97,26.67 IC7.5 | IC8.3 v9.84,13.02 11.11,14.29 IC8.5 | IC9.3 v17.46,13.02 18.73,14.29 IC9.5 | IC10.3 v25.08,13.02 26.35,14.29 IC10.5 | IC17.3 v32.7,13.02 33.97,14.29 IC17.5 35.48,15.32 C41.-
  Bottom 0.305: v32.7,25.4 31.43,26.67 26.35,26.67 v25.08,25.4 23.81,26.67 18.73,26.67 v17.46,25.4 16.19,26.67 11.11,26.67 v9.84,25.4 9.84,14.92 10.48,14.29 | v32.7,13.02 31.43,14.29 26.35,14.29 v25.08,13.02 23.81,14.29 18.73,14.29 v17.46,13.02 16.19,14.29 10.48,14.29 | v9.84,13.02 9.84,13.65 10.48,14.29 | C43.2 R38.2
  Bottom 0.813: C43.2 C41.-
IN_R  (via drill 0.3, 0.3 pad 0.3)
  Top 0.305: IC14.3 v9.84,52.7 11.11,53.98 IC14.5 | IC13.3 v17.46,52.7 18.73,53.98 IC13.5 | IC12.3 v25.08,52.7 26.35,53.98 IC12.5 | IC11.3 v32.7,52.7 33.97,53.98 IC11.5 | IC15.3 v32.7,40.32 33.97,41.59 IC15.5 37.86,42.62 39.05,43.81 v42.55,43.81 | IC16.3 v25.08,40.32 26.35,41.59 IC16.5 | IC18.3 v17.46,40.32 18.73,41.59 IC18.5 | IC19.3 v9.84,40.32 11.11,41.59 IC19.5
  Bottom 0.305: v32.7,40.32 31.43,41.59 26.35,41.59 v25.08,40.32 23.81,41.59 18.73,41.59 v17.46,40.32 16.19,41.59 10.48,41.59 | v32.7,52.7 31.43,53.98 26.35,53.98 v25.08,52.7 23.81,53.98 18.73,53.98 v17.46,52.7 16.19,53.98 11.11,53.98 v9.84,52.7 9.84,42.23 10.48,41.59 | 10.48,41.59 9.84,40.96 v9.84,40.32 | R37.2 42.54,29.21 40.64,29.21 | v42.55,43.81 42.55,33.34 40.64,31.43 C42.2
  Bottom 0.813: C40.- 40.64,29.21 C42.2
N$1
  Bottom 0.305: R1.3A 49.91,32 49.53,32.38 SV2.1
N$2
  Bottom 0.813: C59.- 48.2,51.49 X3.R 48.2,46.1 49.21,45.09 SV4.2
N$3
  Bottom 0.813: C60.- 45.86,40.5 X3.T 51.55,42.55 SV4.3
N$4
  Bottom 0.305: R1.3B 49.38,30 49.22,29.84 SV2.2
N$12
  Top 0.406: IC4.6 IC4.7 R11.1
N$13
  Top 0.406: R12.1 IC5.2 IC5.1
N$14
  Top 0.305: R5.1 LED1.A
N$15
  Top 0.305: R6.1 53.02,10.79 56.83,10.79 LED2.K
N$16  (via drill 0.3 pad 0.3)
  Top 0.305: R7.1 43.5,24.13 v44.13,24.77
  Bottom 0.305: IC3.2 41.27,22.86 R8.2 43.18,24.77 v44.13,24.77
N$17
  Top 0.305: R42.2 41.27,24.77 C42.1
  Bottom 0.305: IC3.1 40.01,24.77 C42.1
N$18  (via drill 0.3 pad 0.3)
  Top 0.305: R21.1 v44.13,13.97
  Bottom 0.305: IC3.6 42.55,13.02 R22.2 43.18,13.02 43.81,13.02 44.13,13.34 v44.13,13.97
N$19
  Top 0.406: IC8.1 IC8.2 R9.1
N$20
  Top 0.406: IC11.1 IC11.2 R23.1
N$21
  Top 0.406: IC4.1 IC4.2 R10.1
N$22
  Top 0.406: IC5.6 IC5.7 R13.1
N$23
  Top 0.406: R14.1 IC6.2 IC6.1
N$24
  Top 0.406: R15.1 IC6.7 IC6.6
N$25
  Top 0.406: IC7.1 IC7.2 R16.1
N$26
  Top 0.406: IC7.6 IC7.7 R17.1
N$27
  Top 0.406: IC11.6 IC11.7 R24.1
N$28
  Top 0.406: IC8.6 IC8.7 R18.1
N$29
  Top 0.406: IC9.1 IC9.2 R19.1
N$30
  Top 0.406: IC9.6 IC9.7 R20.1
N$31
  Top 0.406: IC12.1 IC12.2 R25.1
N$32
  Top 0.406: IC12.6 IC12.7 R26.1
N$33
  Bottom 0.305: IC3.5 46.28,16.43 47.94,18.1 47.94,22.23 51.72,26 R1.2B
N$34
  Top 0.406: IC13.1 IC13.2 R27.1
N$35
  Top 0.406: IC13.6 IC13.7 R28.1
N$36
  Top 0.406: IC14.1 IC14.2 R29.1
N$37
  Top 0.406: IC14.6 IC14.7 R30.1
N$38
  Top 0.406: IC15.1 IC15.2 R31.1
N$39
  Top 0.406: IC15.6 IC15.7 R32.1
N$40
  Top 0.406: IC16.1 IC16.2 R33.1
N$41
  Top 0.406: IC16.6 IC16.7 R34.1
N$42
  Bottom 0.305: IC3.3 42.55,22.86 42.86,23.18 43.81,23.18 46.04,25.4 49.53,25.4 52.13,28 R1.2A
N$47
  Top 0.305: R43.2 R41.1 R21.2
N$48
  Top 0.305: R7.2 R42.1 R44.2
N$49
  Top 0.406: IC18.1 IC18.2 R49.1
N$50
  Top 0.406: IC10.1 IC10.2 R45.1
N$51
  Top 0.406: IC10.6 IC10.7 R46.1
N$52
  Top 0.406: IC17.1 IC17.2 R47.1
N$53
  Top 0.406: IC17.6 IC17.7 R48.1
N$55
  Top 0.406: IC18.6 IC18.7 R50.1
N$56
  Top 0.406: IC19.1 IC19.2 R51.1
N$57
  Top 0.406: IC19.6 IC19.7 R52.1
N$123
  Top 0.305: R41.2 41.91,13.97 C43.1
  Bottom 0.305: C43.1 41.27,13.34 IC3.7
OUT_L  (via drill 0.3, 0.3 pad 0.3)
  Top 0.254: 39.05,14.61 R43.1
  Top 0.305: 39.05,14.61 v39.05,13.97
  Top 0.61: R17.2 v34.61,30.16 | v26.99,30.16 R15.2 | R13.2 v19.37,30.16 | R11.2 v11.75,30.16 | v11.75,20 R10.2 R18.2 | v19.37,20 R12.2 R20.2 | v26.99,20 R14.2 R46.2 | v34.61,20 R16.2 R48.2 | R47.2 v34.61,7.62 | v26.99,7.62 R45.2 | R19.2 v19.37,7.62 | R9.2 v11.75,7.62
  Bottom 0.305: v39.05,13.97 38.73,13.65 35.88,13.65
  Bottom 0.61: v34.61,30.16 33.97,30.8 27.62,30.8 v26.99,30.16 26.35,30.8 20,30.8 v19.37,30.16 18.73,30.8 12.38,30.8 v11.75,30.16 | v11.75,20 12.38,19.37 18.73,19.37 v19.37,20 20,19.37 26.35,19.37 v26.99,20 27.62,19.37 33.97,19.37 v34.61,20 | v34.61,7.62 33.97,6.99 27.62,6.99 v26.99,7.62 26.35,6.99 20,6.99 v19.37,7.62 18.73,6.99 12.38,6.99 v11.75,7.62
  Bottom 0.813: v34.61,7.62 34.61,8.89 35.88,10.16 35.88,13.65 35.88,18.73 v34.61,20 34.61,21.27 35.88,22.54 35.88,28.89 v34.61,30.16 34.61,30.48 37.47,33.34 37.47,38.73 C60.+ 38.73,42.55 SV1.3
OUT_R  (via drill 0.3, 0.3 pad 0.3)
  Top 0.305: v39.05,24.45 R44.1 | v34.61,34.92 34.92,34.61 v39.05,34.61
  Top 0.61: R24.2 v34.61,57.47 | v26.99,57.47 R26.2 | R28.2 v19.37,57.47 | R30.2 v11.75,57.47 | v11.75,47.31 R29.2 R52.2 | v19.37,47.31 R27.2 R50.2 | v26.99,47.31 R25.2 R34.2 | v34.61,47.31 R23.2 R32.2 | R51.2 v11.75,34.92 | v19.37,34.92 R49.2 | v34.61,34.92 R31.2 | R33.2 v26.99,34.92
  Bottom 0.305: v39.05,34.61 v39.05,24.45
  Bottom 0.61: v34.61,57.47 33.97,58.1 27.62,58.1 v26.99,57.47 26.35,58.1 20,58.1 v19.37,57.47 18.73,58.1 12.38,58.1 v11.75,57.47 | v11.75,47.31 12.38,46.67 18.73,46.67 v19.37,47.31 20,46.67 26.35,46.67 v26.99,47.31 27.62,46.67 33.97,46.67 v34.61,47.31 | v11.75,34.92 12.38,34.29 18.73,34.29 v19.37,34.92 20,34.29 26.35,34.29 v26.99,34.92 27.62,34.29 33.97,34.29 v34.61,34.92
  Bottom 0.813: SV1.2 41.27,53.34 C59.+ 39.37,55.24 35.56,55.24 | v34.61,57.47 35.56,56.52 35.56,55.24 | 35.56,55.24 35.56,50.16 34.61,49.21 v34.61,47.31 35.56,46.35 35.56,37.78 34.61,36.83 v34.61,34.92

### Text on the board
tPlace: Right Amp | G | R | L | + | - | R | G | +-15V | L | G | Audio Input | Left Amp
bPlace: joseng.de / Headphone / Amp / OPA2604